# Altium schematic sheet DB10025_Toplevel.SchDoc
size A3
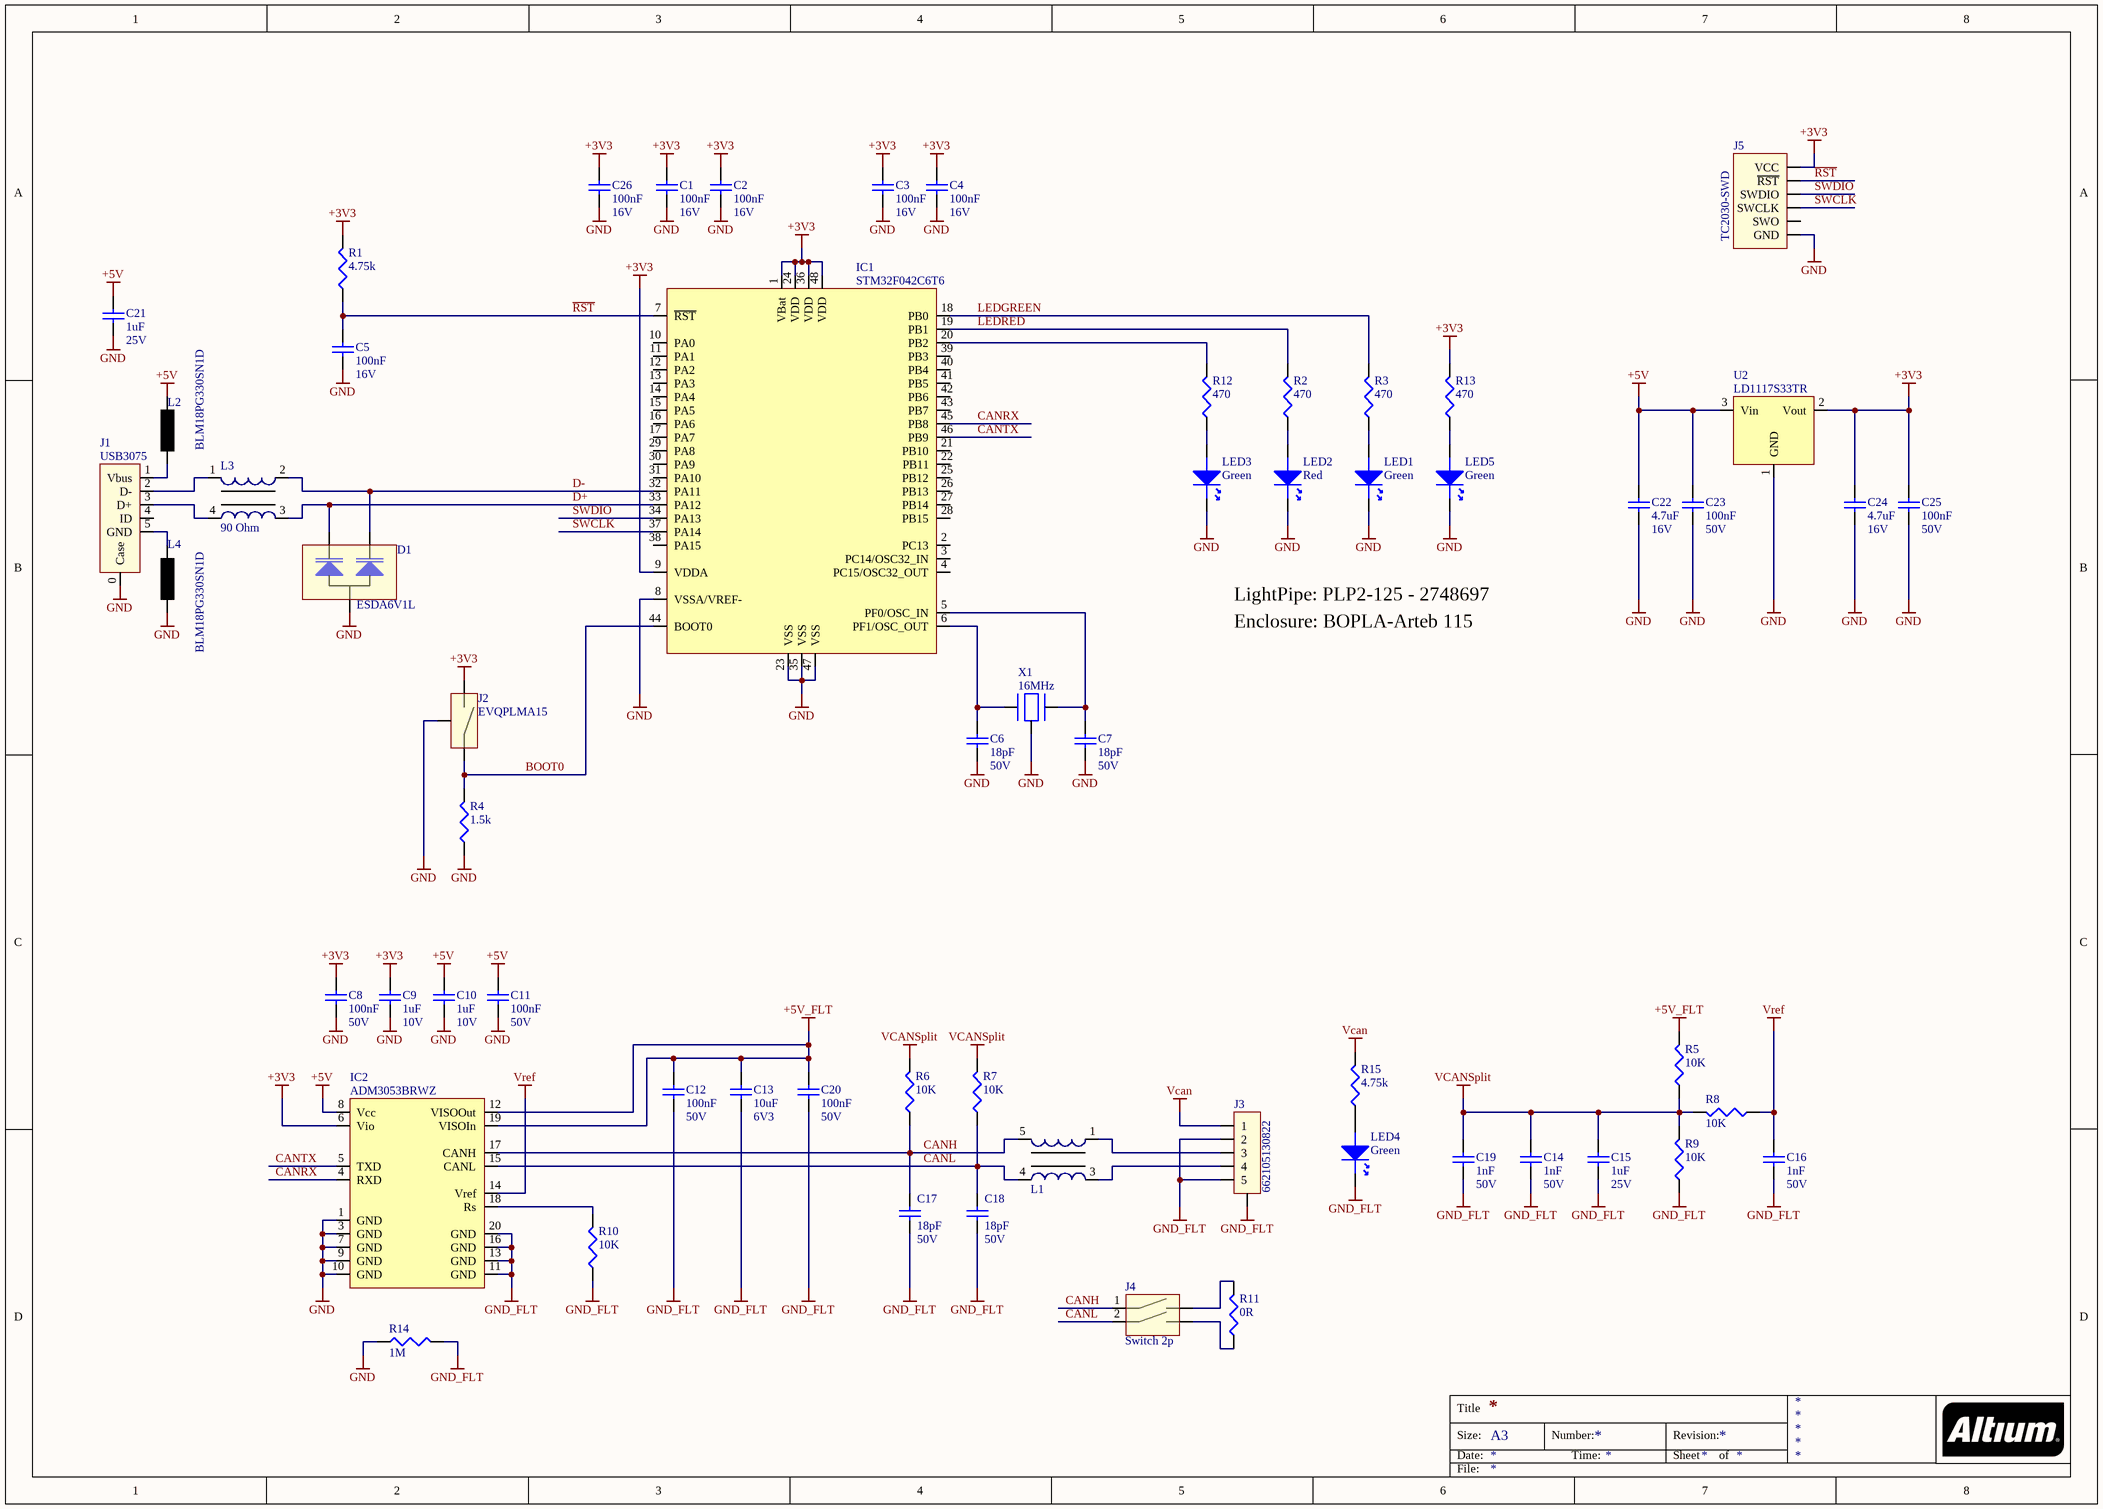
[diagram p0: DB10025_Toplevel.SchDoc]

## Parts
C1  100nF  Voltage Rating: 16V  [C0402]
C2  100nF  Voltage Rating: 16V  [C0402]
C3  100nF  Voltage Rating: 16V  [C0402]
C4  100nF  Voltage Rating: 16V  [C0402]
C5  100nF  Voltage Rating: 16V  [C0402]
C6  18pF  Voltage Rating: 50V  [C0402]
C7  18pF  Voltage Rating: 50V  [C0402]
C8  100nF  Voltage Rating: 50V  [C0603]
C9  1uF  Voltage Rating: 10V  [C0603]
C10  1uF  Voltage Rating: 10V  [C0603]
C11  100nF  Voltage Rating: 50V  [C0603]
C12  100nF  Voltage Rating: 50V  [C0603]
C13  10uF  Voltage Rating: 6V3  [C0603]
C14  1nF  Voltage Rating: 50V  [C0603]
C15  1uF  Voltage Rating: 25V  [C0603]
C16  1nF  Voltage Rating: 50V  [C0603]
C17  18pF  Voltage Rating: 50V  [C0603]
C18  18pF  Voltage Rating: 50V  [C0603]
C19  1nF  Voltage Rating: 50V  [C0603]
C20  100nF  Voltage Rating: 50V  [C0603]
C21  1uF  Voltage Rating: 25V  [C0603]
C22  4.7uF  Voltage Rating: 16V  [C-0805]
C23  100nF  Voltage Rating: 50V  [C-0805]
C24  4.7uF  Voltage Rating: 16V  [C-0805]
C25  100nF  Voltage Rating: 50V  [C-0805]
C26  100nF  Voltage Rating: 16V  [C0402]
D1  ESDA6V1L  [SOT23]
IC1  STM32F042C6T6  [LQFP48]
IC2  ADM3053BRWZ  [SOIC20]
J1  USB3075  [USB3075]
J2  EVQPLMA15  [EVQPLM]
J3  662105130822  [662105130822]
J4  Switch 2p  [MCEMR-02]
J5  TC2030-SWD  [TC2030-IDC-NL]  (no BOM)
L1  CAN filter  [WE-SL1]  (value not drawn)
L2  BLM18PG330SN1D  [L0603]
L3  90 Ohm  [WE-CNSW, 1206]
L4  BLM18PG330SN1D  [L0603]
LED1  Green  [WL-SMSW_1204]
LED2  Red  [WL-SMSW_1204]
LED3  Green  [D-0805]
LED4  Green  [WL-SMSW_1204]
LED5  Green  [D-0805]
R1  4.75k  [0402]
R2  470  [0402]
R3  470  [0402]
R4  1.5k  [0402]
R5  10K  [0603]
R6  10K  [0603]
R7  10K  [0603]
R8  10K  [0603]
R9  10K  [0603]
R10  10K  [0603]
R11  0R  [0805]
R12  470  [0402]
R13  470  [0402]
R14  1M  [1206]
R15  4.75k  [0402]
U2  LD1117S33TR  [SOT223]
X1  16MHz  [7M]

## Nets
+3V3: C1.2 C2.2 C3.2 C4.2 C8.2 C9.2 C24.2 C25.2 C26.2 IC1.1(VBat) IC1.9(VDDA) IC1.24(VDD) IC1.36(VDD) IC1.48(VDD) IC2.6(Vio) J2.2 J5.1(VCC) R1.2 R13.2 U2.2(Vout)
+5V: C10.2 C11.2 C21.2 C22.2 C23.2 IC2.8(Vcc) L2.2 U2.3(Vin)
+5V_FLT: C12.2 C13.2 C20.2 IC2.12(VISOOut) IC2.19(VISOIn) R5.2
GND: C1.1 C2.1 C3.1 C4.1 C5.1 C6.1 C7.1 C8.1 C9.1 C10.1 C11.1 C21.1 C22.1 C23.1 C24.1 C25.1 C26.1 D1.A IC1.8(VSSA/VREF-) IC1.23(VSS) IC1.35(VSS) IC1.47(VSS) IC2.1(GND) IC2.3(GND) IC2.7(GND) IC2.9(GND) IC2.10(GND) J1.0(Case) J2.0(GND) J5.5(GND) L4.1 LED1.1(K) LED2.1(K) LED3.K LED5.K R4.1 R14.1 U2.1(GND) X1.0
GND_FLT: C12.1 C13.1 C14.1 C15.1 C16.1 C17.1 C18.1 C19.1 C20.1 IC2.11(GND) IC2.13(GND) IC2.16(GND) IC2.20(GND) J3.0(SHLD) J3.2 J3.5 LED4.1(K) R9.1 R10.1 R14.2
Vcan: J3.1 R15.2
VCANSplit: C14.2 C15.2 C19.2 R5.1 R6.2 R7.2 R8.2 R9.2
Vref: C16.2 IC2.14(Vref) R8.1
BOOT0: IC1.44(BOOT0) J2.1 R4.2
CANH: C17.2 IC2.17(CANH) J4.1 L1.5 R6.1
CANL: C18.2 IC2.15(CANL) J4.2 L1.4 R7.1
CANRX: IC1.45(PB8) IC2.4(RXD)
CANTX: IC1.46(PB9) IC2.5(TXD)
D+: D1.K2 IC1.33(PA12) L3.3
D-: D1.K1 IC1.32(PA11) L3.2
LEDGREEN: IC1.18(PB0) R3.2
LEDRED: IC1.19(PB1) R2.2
~{RST}: C5.2 IC1.7(~{RST}) J5.3(~{RST}) R1.1
SWCLK: IC1.37(PA14) J5.4(SWCLK)
SWDIO: IC1.34(PA13) J5.2(SWDIO)
NetC6_2: C6.2 IC1.6(PF1/OSC_OUT) X1.1
NetC7_2: C7.2 IC1.5(PF0/OSC_IN) X1.2
NetIC1_20: IC1.20(PB2) R12.2
NetIC2_18: IC2.18(Rs) R10.2
NetJ1_1: J1.1(Vbus) L2.1
NetJ1_2: J1.2(D-) L3.1
NetJ1_3: J1.3(D+) L3.4
NetJ1_5: J1.5(GND) L4.2
NetJ3_3: J3.3 L1.1
NetJ3_4: J3.4 L1.3
NetJ4_3: J4.3 R11.1
NetJ4_4: J4.4 R11.2
NetLED1_2: LED1.2(A) R3.1
NetLED2_2: LED2.2(A) R2.1
NetLED3_A: LED3.A R12.1
NetLED4_2: LED4.2(A) R15.1
NetLED5_A: LED5.A R13.1

Not connected (* = marked no-connect by the designer): IC1 2(PC13) 3(PC14/OSC32_IN) 4(PC15/OSC32_OUT) 10(PA0) 11(PA1) 12(PA2) 13(PA3) 14(PA4) 15(PA5) 16(PA6) 17(PA7) 21(PB10) 22(PB11) 25(PB12) 26(PB13) 27(PB14) 28(PB15) 29(PA8) 30(PA9) 31(PA10) 38(PA15) 39(PB3) 40(PB4) 41(PB5) 42(PB6) 43(PB7); J1 4(ID); J5 6(SWO)

## Notes on the sheet
- LightPipe: PLP2-125 - 2748697
- Enclosure: BOPLA-Arteb 115
- Title
- Size:
- Date:
- A3
- Number:
- Time:
- Revision:
- Sheet
- of
- File:

## Library data of the parts
C1-C5 C26 = 100nF/0402/CER/16V: Capacitor, 100nF, 16V, X7R; Capacitance Tolerance: 10nF; Capacitor Case Style: 0402; Brand Number: GRM155R71C104KA88D; Brand: MURATA; Dielectric Characteristic: X7R; Capacitance: 100nF; Temperature Range: -55 to +125 C; Price: 0,001; Order Code Supplier: 2408523; Supplier: Farnell
C6 C7 = 18pF/0402/CER/50V: Capacitor, 18pF, 50V, NP0; Capacitance Tolerance: ± 5%; Capacitor Case Style: 0402; Brand Number: GRM1555C1H180JA01D; Brand: MURATA; Dielectric Characteristic: NP0; Capacitance: 18pF; Temperature Range: -55°C to 125°C; Price: 0,0177; Order Code Supplier: 1828876; Supplier: Farnell
C8 C11 C12 C20 = 100nF/0603/CER/50V: Capacitor, 100nF, 50V, X7R; Capacitance Tolerance: ± 10%; Capacitor Case Style: 0603; Brand Number: MCCA000255; Brand: MULTICOMP; Dielectric Characteristic: X7R; Capacitance: 100nF; Temperature Range: -55°C to +125°C; Price: 0,008; Order Code Supplier: 1759122RL; Supplier: Farnell
C9 C10 = 1uF/0603/CER/10V/X5R: Capacitor, 1uF, 10V, X5R; Capacitance Tolerance: ± 10%; Brand Number: C1608X5R1A105K080AC; Brand: TDK; Dielectric Characteristic: X5R; Capacitance: 1uF; Capacitor Case Style: C0603; Temperature Range: -55°C to +85°C; Price: 0,0083; Order Code Supplier: 2346890; Supplier: Farnell
C13 = 10uF/0603/CER/6V3/X5R: Capacitor, 10uF, 6.3V, X5R; Capacitance Tolerance: ± 20%; Brand Number: GRM188R60J106ME47D; Brand: MURATA; Dielectric Characteristic: X5R; Capacitance: 10uF; Capacitor Case Style: C0603; Temperature Range: -55°C to +85°C; Price: 0,117; Order Code Supplier: 1735528; Supplier: Farnell
C14 C16 C19 = 1nF/0603/CER/50V: Capacitor, 1nF, 50V, X7R; Capacitance Tolerance: ± 10%; Capacitor Case Style: 0603; Brand Number: C0603C102K5RACTU; Brand: KEMET; Dielectric Characteristic: X7R; Capacitance: 1nF; Temperature Range: -55°C to +125°C; Price: 0,011; Order Code Supplier: 1414608; Supplier: Farnell
C15 C21 = 1uF/0603/CER/25V: Capacitor, 1uF, 25V, X7R; Capacitance Tolerance: ± 10%; Capacitor Case Style: 0603; Brand Number: GRM188R71E105KA12D; Brand: MURATA; Dielectric Characteristic: X7R; Capacitance: 1uF; Temperature Range: -55°C to +125°C; Price: 0,186; Order Code Supplier: 1735540; Supplier: Farnell
C17 C18 = 18pF/0603/CER/50V: Capacitor, 18pF, 50V, C0G / NP0; Capacitance Tolerance: ± 5%; Capacitor Case Style: 0603; Brand Number: MC0603N180J500CT; Brand: MULTICOMP; Dielectric Characteristic: C0G / NP0; Capacitance: 18pF; Temperature Range: -55°C to +125°C; Price: 0,009; Order Code Supplier: 1759056; Supplier: Farnell
C22 C24 = 4.7uF/0805/CER/16V: Capacitor, 4.7uF, 16V, X7R; Capacitance Tolerance: ± 10%; Capacitor Case Style: 0805; Brand Number: GRM21BR71C475KA73L; Brand: MURATA; Dielectric Characteristic: X7R; Capacitance: 4.7uF; Temperature Range: -55°C to +125°C; Price: 0,26; Order Code Supplier: 1797015; Supplier: Farnell
C23 C25 = 100nF/0805/CER/50V: Capacitor, 100nF, 50V,  X7R; Capacitance Tolerance: ± 10%; Capacitor Case Style: 0805; Brand Number: C0805C104K5RACTU; Brand: KEMET; Dielectric Characteristic: X7R; Capacitance: 100nF; Temperature Range: -55°C to +125°C; Price: 0,022; Order Code Supplier: 1414664; Supplier: Farnell
D1 = ESDA6V1L: Diode TVS Dual, Vrwm: 5.25V, Vbr: 7.2V, Vc: 12.45V, Ippm: 15A; Brand: STMICROELECTRONICS; Case Style: SOT-23; Brand Number: ESDA6V1L; Breakdown Voltage: 7.2V; Clamping Voltage: 12.45V; Ippm: 15A; Order Code Supplier: 9802258; Price: 0,62; Supplier: Farnell; Temperature Range: -40°C to +125°C; Vrwm: 5.25V
IC1 = STM32F042C6T6: MCU, 32BIT CORTEX-M3, 72MHz; Brand: STM; Brand Number: STM32F042C6T6; Supplier: Farnell; Order Code Supplier: 2750630
IC2 = ADM3053BRWZ: CAN Transceiver isolated; Brand: Analog devices; Brand Number: ADM3053BRWZ; Case Style: SOIC20; Order Code Supplier: 2062027; Price: 10,48; Supplier: Farnell; Temperature Range: -55°C to +155°C
J1 = USB3075: USB 2.0 MICRO B, RCPT, 5POS, SMT; Brand: Global Connector Technology; Brand Number: USB3075-30-A; Case Style: Micro B SMT; Pitch: 0.8mm; Order Code Supplier: 2443116; Price: 0,313; Supplier: Farnell
J2 = EVQPLMA15: SWITCH, TACT, 4.9MM, SMD, 2.6N; Brand: PANASONIC ELECTRONIC COMPONENTS; Brand Number: EVQPLMA15; Price: 0,169; Order Code Supplier: 2079484; Supplier: Farnell
J3 = 662105130822: WR-MPC3 Series, 5Pin, Right Angle; Brand: Wurth; Pitch: 3mm; Brand Number: 662105130822; Case Style: WR-MPC3; Order Code Supplier: 662105130822; Price: -; Supplier: Wurth
J4 = WE-418121160802: SWITCH, DIL, SMD, 2WAY, SPST; Brand: WURTH ELEKTRONIK; Brand Number: 418121160802; Price: 0,0; Order Code Supplier: 418121160802; Supplier: WURTH ELEKTRONIK
J5 = TC2030-SWD: TagConnect 2030; Brand Number: TC2030; Brand: TagConnect; Case Style: TC2030; Order Code Supplier: -; Pitch: -; Price: -; Supplier: -
L1 = 744212510: Common mode CAN filter; Brand: WURTH ELEKTRONIK; Brand Number: 744212510; Price: 5,38; Order Code Supplier: 1848219; Supplier: Farnell
L2 L4 = BLM18PG330SN1D: Ferrite Bead, Impedance:33ohm, DC Resistance Max:0.025ohm, DC Current Rating:3A; Brand: MURATA; Case Style: 0603; Brand Number: BLM18PG330SN1D; Price: 0,048; Supplier: Farnell; Order Code Supplier: 1515742
L3 = WE-CNSW 1206, 744232090: SMD Common Mode Noise Suppressor WE-CNSW,  Z= 90 Ohm; Manufacturer: Würth Elektronik eiSos GmbH; partNo: 744232090; Impedance: 90 Ohm; ComponentLink1Description: Manufacturer; ComponentLink1URL: http://www.we-online.de; Created by: Christin Zierenner; Created Date: November 2009; ComponentLink2Description: Datasheet; ComponentLink2URL: http://www.we-online.de/katalog/media/pdf/744232090.pdf
LED1 LED4 = 155124GS73200: 1204 LED Green Side; Brand: Wurth; Order Code Supplier: 2322100; Supplier: Farnell; Price: 0,684; Brand Number: 155124GS73200
LED2 = 155124RS73200: 1204 LED Red Side; Brand: Wurth; Order Code Supplier: 2322101; Supplier: Farnell; Price: 0,684; Brand Number: 155124RS73200
LED3 LED5 = SML-210MTT86N: Led, Yellowish Green, Li:16mcd, Vf:2.2V, If:0.025A; Brand: ROHM; Case Style: 0805; Forward Current: 0.025A; Forward Voltage: 2.2V; Luminous Intensity: 16mcd; Brand Number: SML-210MTT86N; Order Code Supplier: 1525568; Price: 0,24; Supplier: Farnell; Temperature Range: -30°C to +85°C
R1 R15 = 4.75k/0402/0063W/50V: Resistor, 4.75k, 0.1%, 0.0625W, 50V, 100PPM, 0402; Brand: VISHAY DRALORIC; Brand Number: CRCW04024K75FKED; Power Rating: 0.063W; Case Style: 0402; Order Code Supplier: 2121689; Price: 0,0006; Resistance: 4.75k; Supplier: Farnell; Temperature Coefficient: ± 100PPM; Temperature Range: -55°C to +125°C; Voltage Rating: 50V
R2 R3 R12 R13 = 470/0402/0063W/50V: Resistor, 470, 1%, 0.0625W, 50V, 100PPM, 0402; Brand: VISHAY DRALORIC; Brand Number: CRG0402F470R; Power Rating: 0.063W; Case Style: 0402; Order Code Supplier: 2331533; Price: 0,0099; Resistance: 470; Supplier: Farnell; Temperature Coefficient: ± 100PPM; Temperature Range: -55°C to +125°C; Voltage Rating: 50V
R4 = 1.5k/0402/0063W/50V: Resistor, 1.5k, 0.1%, 0.0625W, 50V, 100PPM, 0402; Brand: VISHAY DRALORIC; Brand Number: CRCW04021K50FKED; Power Rating: 0.063W; Case Style: 0402; Order Code Supplier: 2121624; Price: 0,0054; Resistance: 1.5k; Supplier: Farnell; Temperature Coefficient: ± 100PPM; Temperature Range: -55°C to +125°C; Voltage Rating: 50V
R5-R10 = 10K/0603/0063W/50V: Resistor, 10K, 1%, 0.063W, 50V, 100PPM, 0603; Brand: VISHAY DRALORIC; Brand Number: CRCW060310K0FKEA; Case Style: 0603; Order Code Supplier: 2122493; Power Rating: 0.063W; Price: 0,038; Resistance: 10K; Supplier: Farnell; Temperature Coefficient: ± 100PPM; Temperature Range: -55°C to +125°C; Voltage Rating: 50V
R11 = 0/0805/0100W/150V: Resistor, 0R, 0.1%, 0.1W, 150V, 200PPM, 0805; Brand: MULTICOMP; Brand Number: MC 0.1W 0805 0R; Case Style: 0805; Order Code Supplier: 9333681; Power Rating: 0.1W; Price: 0,038; Resistance: 0R; Supplier: Farnell; Temperature Coefficient: ± 200PPM; Temperature Range: -55°C to +125°C; Voltage Rating: 150V
R14 = 1M/1206/0300W/1kV: Resistor, 1M, 1%, 0.25W, 1kV, 200PPM, 1206; Brand: WELWYN; Brand Number: HVC1206-1M0FT3; Power Rating: 0.3W; Temperature Coefficient: ± 100PPM; Case Style: 1206; Order Code Supplier: 2340649; Price: 1,44; Resistance: 1M; Supplier: Farnell; Temperature Range: -55°C to +155°C; Voltage Rating: 1kV
U2 = LD1117S33TR: LD1117S33TR - 3.3V LDO, REG, 0.8A, SOT223; Brand: STMICROELECTRONICS; Case Style: SOT-223; Vin-min: 4.75V; Vin-max: 15V; Brand Number: LD1117S33TR; Current: 0.8A; Vout: 3.3V; Order Code Supplier: 1202826; Price: 0,60; Supplier: Farnell; Temperature Range: -40°C to +85°C
X1 = 7M-16.000MAAJ-T: CRYSTAL, 16MHz,18PF CL, 3.2X2.5MM SMT; Brand: TXC; Order Code Supplier: 1842060; Price: 1,45; Supplier: Farnell; Brand Number: 7M-16.000MAAJ-T